# EAGLE design Adafruit Infineon Trust M (EAGLE 9.5.0)
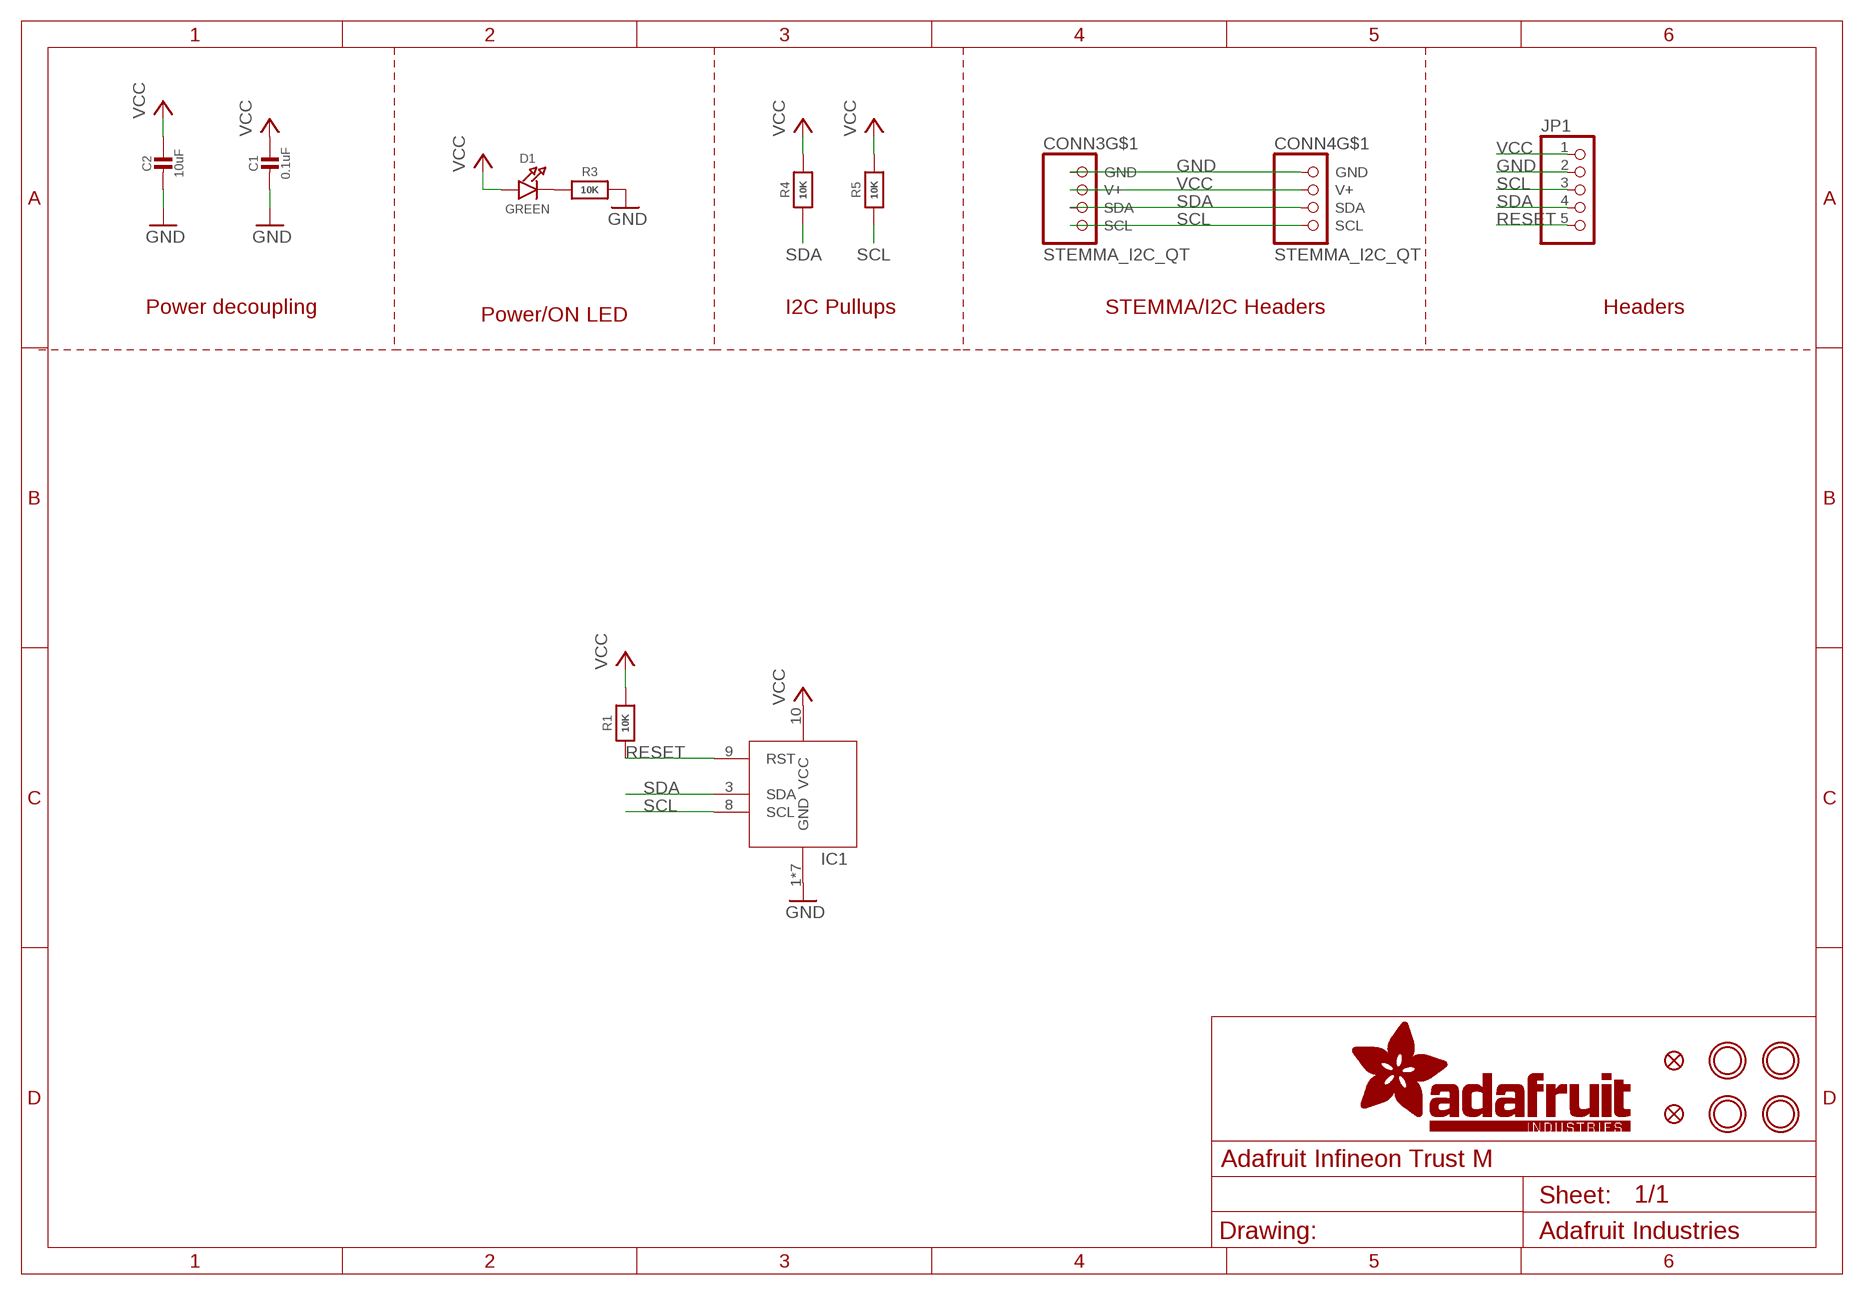
[diagram p0: schematic, sheet 1]

## Parts
C1  0.1uF  CAP_CERAMIC0603_NO  [0603-NO]
C2  10uF  CAP_CERAMIC0805-NOOUTLINE  [0805-NO]
CONN3  STEMMA_I2C_QT  [JST_SH4]
CONN4  STEMMA_I2C_QT  [JST_SH4]
D1  GREEN  LED0603_NOOUTLINE  [CHIPLED_0603_NOOUTLINE]
FID3  FIDUCIAL_1MM  [FIDUCIAL_1MM]
FID4  FIDUCIAL_1MM  [FIDUCIAL_1MM]
IC1  OPTIGA_TRUST_X  [PG-USON10-10-2]
JP1  HEADER-1X570MIL  [1X05_ROUND_70]
R1  10K  RESISTOR_0603_NOOUT  [0603-NO]
R3  10K  RESISTOR_0603_NOOUT  [0603-NO]
R4  10K  RESISTOR_0603_NOOUT  [0603-NO]
R5  10K  RESISTOR_0603_NOOUT  [0603-NO]
U$11  MOUNTINGHOLE2.5  [MOUNTINGHOLE_2.5_PLATED]
U$12  MOUNTINGHOLE2.5  [MOUNTINGHOLE_2.5_PLATED]
U$14  MOUNTINGHOLE2.5  [MOUNTINGHOLE_2.5_PLATED]
U$15  MOUNTINGHOLE2.5  [MOUNTINGHOLE_2.5_PLATED]

## Nets
GND: C1.2 C2.2 CONN3.1(GND) CONN4.1(GND) IC1.1(GND) IC1.2(GND) IC1.4(GND) IC1.5(GND) IC1.6(GND) IC1.7(GND) IC1.THERM(GND) JP1.2 R3.2
N$1: D1.C R3.1
RESET: IC1.9(RST) JP1.5 R1.1
SCL: CONN3.4(SCL) CONN4.4(SCL) IC1.8(SCL) JP1.3 R5.1
SDA: CONN3.3(SDA) CONN4.3(SDA) IC1.3(SDA) JP1.4 R4.1
VCC: C1.1 C2.1 CONN3.2(V+) CONN4.2(V+) D1.A IC1.10(VCC) JP1.1 R1.2 R4.2 R5.2
Unconnected: CONN3.MT1(MT) CONN3.MT2(MT) CONN4.MT1(MT) CONN4.MT2(MT)

## Notes on the sheet
- Power decoupling | Power/ON LED | I2C Pullups | STEMMA/I2C Headers | Headers

## Library data of the parts
C1 C2 = microbuilder:CAP_CERAMIC: Ceramic Capacitors For new designs, use the packages preceded by an '_' character since they are more reliable: The following footprints should be used on most boards: _0402 - Standard footprint for regular board layouts _0603 - Standard footprint for regular board layouts _0805 - Standard footprint for regular board layouts _1206 - Standard footprint for regular board layouts For extremely tight-pitch boards where space is at a premium, the following 'micro-pitch' footprints can be used (smaller pads, no silkscreen outline, etc.): _0402MP - Micro-pitch footprint for very dense/compact boards _0603MP - Micro-pitch footprint for very dense/compact boards _0805MP - Micro-pitch footprint for very dense/compact boards _1206MP - Micro-pitch footprint for very dense/compact boards
CONN3 CONN4 = microbuilder:STEMMA_I2C
D1 = microbuilder:LED: LED 0603 - 0603 Surface Mount Package 2mA: Green LED - Low Power (3.9mcd, 2ma, 1.7Vf) - Digikey: 475-2709-2-ND Orange LED - Low Power (9.8mcd, 2ma, 1.8Vf) - Digikey: 475-1194-2-ND Red LED - Low Power (5mcd, 2ma, 1.8Vf) - Digikey: 475-1195-2-ND Yellow LED - Low Power (7mcd, 2ma, 1.8Vf) - Digikey: 475-1196-2-ND 5mA: Blue LED - Low Power (17mcd, 5ma, 2.9Vf) - Digikey: LNJ937W8CRACT-ND 0805 - 0805 Surface Mount Package 2mA: Red LED (8.8mcd, 2mA, 1.8Vf, Clear) - Low Power [Digikey: 475-2510-1-ND] Green LED (5mcd, 2mA, 1.8Vf, Clear) - Low Power [Digikey: 475-2730-1-ND] Yellow LED (11.3mcd, 2mA, 1.8Vf, Clear) - Low Power [Digikey: 475-2555-1-ND] 20mA: Red LED (104mcd, 20mA, Diffused) - LS R976 [Digikey: 475-1278-6-ND] Red LED (12mcd, 20mA, 2.0Vf, Clear) - APT2012EC [Digikey: 754-1128-1-ND] Green LED (15mcd, 20mA, 2.2Vf, Clear) - APT2012GC [Digikey: 754-1131-1-ND] Orange LED (160mcd, 20mA, 2.1Vf, Clear) - APT2012SECK [Digikey: 754-1130-1-ND] 1206 - 1206 Surface Mount Package Green LED (26mcd, 20mA, Diffused) - LG N971 [Digikey: 475-1407-6-ND] Red LED (15mcd, 20mA, Diffused) - LH N974 [Digikey: 475-1416-6-ND] Cree - Cree High-Power Surface Mount LEDs XPEBWT-L1-0000-00D50 - White 111lm 350mA 2.9Vf 6200K 110° XTEAWT-00-0000-00000LEE3 - White 114lm 350mA 2.85Vf 5000K 115° Everlight - Everlight 45-21 Series Surface Mount LEDs 45-21/QK2C-B2832AC2CB2/2T - Warm White 2000mcd 20mA 3.25Vf 3050K 120° 45-21/LK2C-B38452C4CB2/2T - Nuetral White 2000mcd 20mA 3.25Vf 4150K 120° 45-21/LK2C-B50634C6CB2/2T - Cold White 2200mcd 20mA 3.25Vf 5650K 120° PLCC2 Reverse Mount LS T77K-J1L2-1-0-2-R18-Z - Red 11.25mcd 2mA 1.8Vf 630nm 120° LO T77K-L1M2-24-Z - Orange 19.6mcd 2mA 1.8Vf 606nm 120° LY T77K-K2M1-26-Z - Yellow 15.7mcd 2mA 1.8Vf 587nm 120°
FID3 FID4 = microbuilder:FIDUCIAL: Fiducial Alignment Points Various fiducial points for machine vision alignment.; BOM: EXCLUDE
IC1 = microbuilder:OPTIGA_TRUST_X
JP1 = microbuilder:HEADER-1X5: PIN HEADER
R1 R3-R5 = microbuilder:RESISTOR: Resistors For new designs, use the packages preceded by an '_' character since they are more reliable: The following footprints should be used on most boards: _0402 - Standard footprint for regular board layouts _0603 - Standard footprint for regular board layouts _0805 - Standard footprint for regular board layouts _1206 - Standard footprint for regular board layouts For extremely tight-pitch boards where space is at a premium, the following 'micro-pitch' footprints can be used (smaller pads, no silkscreen outline, etc.): _0402MP - Micro-pitch footprint for very dense/compact boards _0603MP - Micro-pitch footprint for very dense/compact boards _0805MP - Micro-pitch footprint for very dense/compact boards _1206MP - Micro-pitch footprint for very dense/compact boards
U$11 U$12 U$14 U$15 = microbuilder:MOUNTINGHOLE: Mounting Hole For #2 screws (0.086"/2.18mm width, 0.094"/2.4mm hole) use 2.5mm; BOM: EXCLUDE

## Board
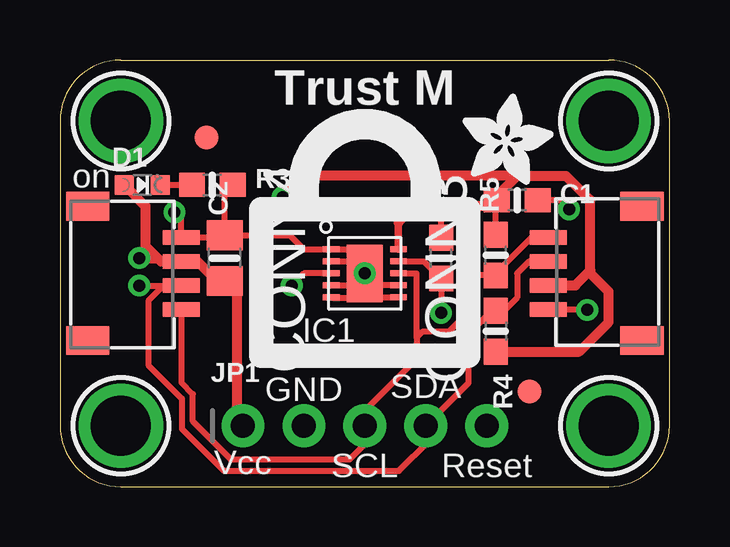
[diagram p1: board, top side]
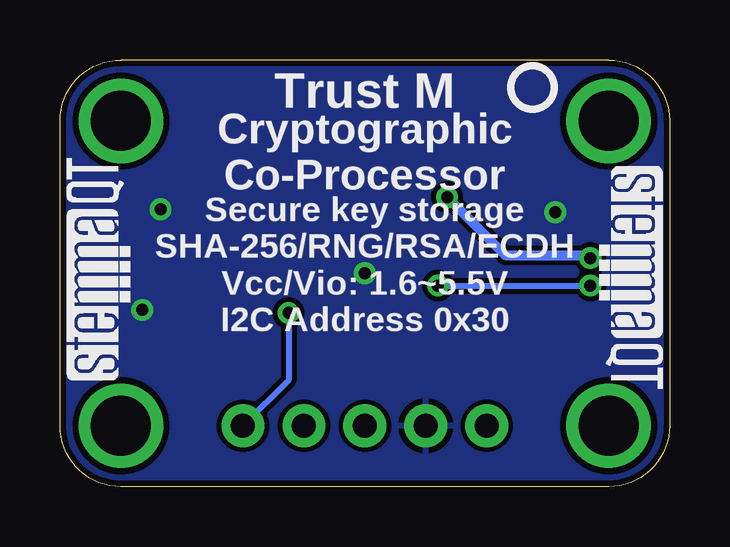
[diagram p2: board, bottom side, seen from below]

Size 25.4 x 17.78 mm. Coordinates in mm from the lower left corner, seen from the top.
Outline: 2.54,17.78 22.86,17.78 arc-90 25.4,15.24 25.4,2.54 arc-90 22.86,0 2.54,0 arc-90 0,2.54 0,15.24 arc-90 2.54,17.78
Copper layers (1*16): Top 0.035mm / dielectric 1.5mm / Bottom 0.035mm
Design rules "adafruit": minimum track width 8mil, minimum drill 15.5mil, track to track 8mil, track to pad 8mil, pad to pad 8mil, via to via 8mil, smd to smd 8mil, copper to edge 10mil, drill to drill 8mil, minimum pad ring 10mil, minimum via ring 8mil, stop-mask expansion 2mil, vias tented up to drill 20mil, thermal gap 10mil

### Footprints (pad centres in the part's own frame; a part is rotated, then mirrored left to right if it is on the bottom)
0603-NO = smd 1.075 x 1: 1 -0.85,0; 2 0.85,0
0805-NO = smd 1.24 x 1.5: 1 -0.95,0; 2 0.95,0
JST_SH4 = smd 0.6 x 1.55: 1 -1.5,2.514; 2 -0.5,2.514; 3 0.5,2.514; 4 1.5,2.514 | smd 1.2 x 1.8: MT1 -2.8,-1.386; MT2 2.8,-1.386
CHIPLED_0603_NOOUTLINE = smd 0.8 x 0.8: A 0,-0.75; C 0,0.75
FIDUCIAL_1MM = smd 1 x 1: 1 0,0
PG-USON10-10-2 = smd 0.7 x 0.25: 1 -1.4,1; 2 -1.4,0.5; 3 -1.4,0; 4 -1.4,-0.5; 5 -1.4,-1; 6 1.4,-1; 7 1.4,-0.5; 8 1.4,0; 9 1.4,0.5; 10 1.4,1 | smd 1.5 x 2.4: THERM 0,0
1X05_ROUND_70 = drill 1 pad 1.778: 1 -5.08,0; 2 -2.54,0; 3 0,0; 4 2.54,0; 5 5.08,0
MOUNTINGHOLE_2.5_PLATED = drill 2.5 pad 3.2: P$1 0,0

### Placement (x,y rotation side)
C1  19.05,11.94 0 top
C2  6.86,9.53 90 top
CONN3  22.86,8.89 90 top
CONN4  2.54,8.89 270 top
D1  3.43,12.57 270 top
FID3  6.1,14.54 0 top
FID4  19.56,3.98 0 top
IC1  12.7,8.89 0 top
JP1  12.7,2.54 0 top
R1  15.88,9.53 90 top
R3  6.35,12.57 0 top
R4  18.16,6.48 270 top
R5  18.16,9.65 90 top
U$11  2.54,15.24 0 top
U$12  22.86,15.24 0 top
U$14  2.54,2.54 0 top
U$15  22.86,2.54 0 top
U$17  [ADAFRUIT_3.5MM]  16.76,12.57 0 top
U$18  [PCBFEAT-REV-040]  5.71,16.64 0 bottom
U$19  [STEMMAQT]  22.48,4.45 90 bottom
U$20  [STEMMAQT]  2.92,13.34 270 bottom

### Tracks (layer width: path | path; a pad name or v marks a point on that pad's centre or on a via)
GND  (via drill 0.5)
  Top 0.254: C2.2 6.77,10.39 CONN4.1 5.05,11.43 v4.77,11.43 | C2.2 6.86,12.23 R3.2 | CONN3.1 21.95,7.39 v21.97,7.37 | 19.94,11.94 C1.2 20.83,11.94 v21.21,11.56 | IC1.4 12.2,8.39 12.45,8.64 | 12.45,8.64 IC1.THERM 12.57,9.02 12.57,9.27 | IC1.5 11.32,7.87 12.57,7.87 | 12.57,7.87 12.57,8.51 | 12.57,8.51 12.45,8.64 | IC1.2 12.57,9.4 12.57,9.27 | 12.57,9.27 11.95,9.89 IC1.1 10.16,9.89 9.57,10.47 C2.2 | IC1.7 12.69,8.39 12.57,8.51 | IC1.6 14.08,7.87 12.57,7.87
  other vias: 12.7,8.89
  pour Bottom: 0,17.78 0,0 25.4,0 25.4,17.78
N$1
  Top 0.254: D1.C R3.1
RESET  (via drill 0.5)
  Top 0.254: IC1.9 15.16,9.39 R1.1 v15.88,7.24
  Bottom 0.254: v15.88,7.24 15.88,4.45 JP1.5
SCL
  Top 0.254: CONN3.4 20.32,10.41 19.68,10.41 18.16,8.89 R5.1 | IC1.8 14.86,8.89 14.86,6.22 | CONN4.4 5.05,4.34 5.54,3.86 5.54,2.72 7.11,1.14 8.89,1.14 12.06,1.14 12.7,1.78 JP1.3 12.7,3.17 14.86,5.33 14.86,5.97 14.86,6.22 | 18,8.8 R5.1 | R5.1 17.44,8.8 16.7,8.07 16.7,6.96 16.2,6.46 15.09,6.46 14.86,6.22
SDA  (via drill 0.5)
  Top 0.254: CONN4.3 4.83,8.39 | 4.83,8.39 4.33,8.39 3.68,7.75 3.68,5.07 5.08,3.67 5.08,2.41 6.83,0.66 14.12,0.66 15.37,1.91 15.24,2.03 JP1.4 17.02,4.32 17.02,6.35 18,7.33 R4.1 18.5,7.33 19.05,7.87 19.05,8.89 19.55,9.39 CONN3.3 | IC1.3 10.16,8.89 v9.65,8.38 | v3.3,8.38 4.82,8.38 4.83,8.39
  Bottom 0.254: v9.65,8.38 v3.3,8.38
VCC  (via drill 0.5)
  Top 0.254: C2.1 7.37,8.57 | 22.04,8.95 22.1,9.02 | 17.95,11.68 C1.1 18.2,12.1 | R5.2 18.16,11.9 | R1.2 15.88,11.56 16,11.68
  Top 0.305: IC1.10 14.1,11.01
  Top 0.406: D1.A 3.56,11.7 3.56,10.03 4.06,9.53 | C2.1 6.54,8.57 5.72,9.39 CONN4.2 4.2,9.39 4.06,9.53 | CONN3.2 21.47,8.39 22.04,8.95 22.86,8.13 22.86,6.86 21.63,5.63 R4.2 | 22.1,9.02 22.1,11.94 21.08,12.95 19.05,12.95 | 17.95,11.68 16,11.68 14.77,11.68 14.1,11.01 | 18.2,12.1 19.05,12.95 | 18.16,11.9 C1.1 | 19.05,12.95 10.16,12.95 v9.27,12.06 | v3.3,9.53 4.06,9.53 | JP1.1 7.37,2.79 7.37,8.57
  Bottom 0.406: v9.27,12.06 6.86,9.65 3.56,9.65 3.43,9.53 v3.3,9.53

### Text on the board
tPlace: Trust M | on | GND | SDA | Vcc | SCL | Reset
bPlace: Trust M | Cryptographic / Co-Processor | Secure key storage / SHA-256/RNG/RSA/ECDH / Vcc/Vio: 1.6~5.5V / I2C Address 0x30